# EAGLE design captouchIC (EAGLE 9.3.0)
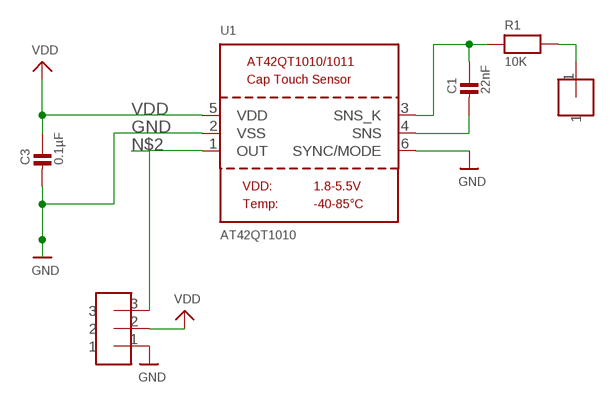
[diagram p0: schematic, sheet 1]

## Parts
C1  22nF  CAP_CERAMIC_0805  [_0805]
C3  0.1µF  CAP_CERAMIC_0805  [_0805]
R1  10K  RESISTOR_0805  [_0805]
U1  AT42QT1010  AT42QT1010/1  [SOT23-6]
U$1  HEADER-1-TESTPOINT  [TESTPOINT-1]
U$6  HEADER-3  [HEADER-3]

## Nets
CAPPAD: R1.2 U$1.1
GND: C3.2 U1.2(VSS) U1.6(SYNC/MODE) U$6.1
N$2: U1.1(OUT) U$6.3
N$3: C1.2 U1.4(SNS)
N$4: C1.1 R1.1 U1.3(SNS_K)
VDD: C3.1 U1.5(VDD) U$6.2

## Library data of the parts
C1 C3 = microbuilder:CAP_CERAMIC: Ceramic Capacitors For new designs, use the packages preceded by an '_' character since they are more reliable: The following footprints should be used on most boards: _0402 - Standard footprint for regular board layouts _0603 - Standard footprint for regular board layouts _0805 - Standard footprint for regular board layouts For extremely tight-pitch boards where space is at a premium, the following 'micro-pitch' footprints can be used (smaller pads, no silkscreen outline, etc.): _0402MP - Micro-pitch footprint for very dense/compact boards _0603MP - Micro-pitch footprint for very dense/compact boards _0805MP - Micro-pitch footprint for very dense/compact boards Commonly Stocked Parts 0402 - 0402 Surface Mount Capacitors 16pF 50V 5% [Digikey: 445-4899-2-ND] 18pF 50V 5% [Digikey: 490-1281-2-ND] 22pF 50V 5% [Digikey: 490-1283-2-ND] 68pF 50V 5% [Digikey: 490-1289-2-ND] 0.1uF 10V 10% [Digikey: 490-1318-2-ND] 1.0uF 6.3V 10% [Digikey: 490-1320-2-ND] 0603 - 0603 Surface Mount Capacitors 16 pF 50V 5% [Digikey: 445-5051-2-ND] 22 pF 50V [Digikey: PCC220ACVTR-ND] 33 pF 50V 5% [Digikey: 490-1415-1-ND] 56pF 50V 5% [Digikey: 490-1421-1-ND] 220pF 50V 5% [Digikey: 445-1285-1-ND] 680 pF 50V 2200 pF 50V 5% C0G [Digikey: 445-1297-1-ND] 5600 pF 100V 5% X7R [Digikey: 478-3711-1-ND] 0.1 µF 25V 10% [Digikey: PCC2277TR-ND] 0.22 µF 16V 10% X7R [Digikey: 445-1318-1-ND] 1.0 µF 25V 10% [Digikey: 445-5146-2-ND] 0603 - RF Specific 3pF 250V +/-0.1pF RF [Digikey: 712-1347-1-ND] 18 pF 250V 5% [Digikey: 478-3505-1-ND or 712-1322-1-ND] 56 pF 250V 5% C0G RF [Digikey: 490-4867-1-ND] 68 pF 250V RF [Digikey: 490-4868-1-ND] 0805 - 0805 Surface Mount Capacitors 220 pF 250V 2% RF Ceramic Capacitor [Digikey: 712-1398-1-ND] 1000 pF 50V 2% NP0 Ceramic Capacitor [Digikey: 478-3760-1-ND] 0.1 µF 25V 10% Ceramic Capacitor [Digikey: PCC1828TR-ND] 1.0 µF 16V 10% Ceramic Capacitor[Digikey: 490-1691-2-ND] 10.0 µF 10V 10% Ceramic Capacitor[Digikey: 709-1228-1-ND] 10.0 uF 16V 10% Ceramic Capacitor [Digikey: 478-5165-2-ND] 47 uF 6.3V 20% Ceramic Capacitor [Digikey: 587-1779-1-ND or 399-5506-1-ND] 1206 - 1206 Surface Mount Capacitors 47uF 10V 20% Ceramic Capacitor [Digikey: 490-5528-1-ND or 399-5508-1-ND or 445-6010-1-ND] 100uF 6.3V -20%, +80% Y5V Ceramic Capacitor (Digikey: 490-4512-1-ND, Mouser: 81-GRM31CF50J107ZE1L)
R1 = microbuilder:RESISTOR: Resistors For new designs, use the packages preceded by an '_' character since they are more reliable: The following footprints should be used on most boards: _0402 - Standard footprint for regular board layouts _0603 - Standard footprint for regular board layouts _0805 - Standard footprint for regular board layouts For extremely tight-pitch boards where space is at a premium, the following 'micro-pitch' footprints can be used (smaller pads, no silkscreen outline, etc.): _0402MP - Micro-pitch footprint for very dense/compact boards _0603MP - Micro-pitch footprint for very dense/compact boards _0805MP - Micro-pitch footprint for very dense/compact boards
U1 = microbuilder:AT42QT1010/1: AT42QT1010/1011 - Single Button Cap Touch Sensors AT42QT1010 - Auto recalibration AT42QT1011 - Remains on as long as touch is detected
U$1 = homemade-hardware:HEADER-1
U$6 = homemade-hardware:HEADER-3

## Board
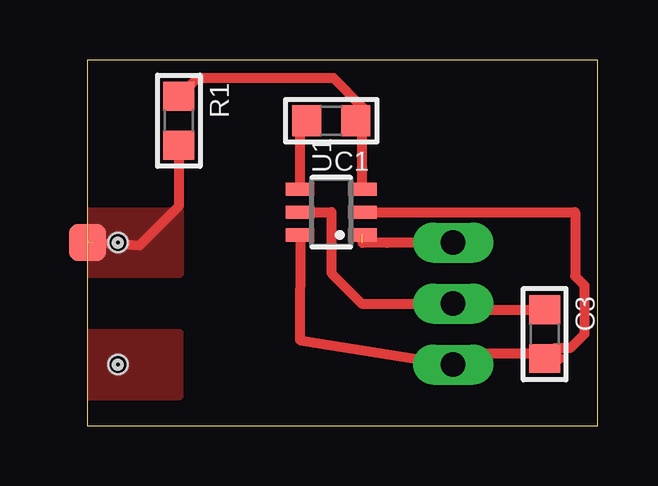
[diagram p1: board, top side]

Size 21.26 x 15.23 mm. Coordinates in mm from the lower left corner, seen from the top.
Outline: 0,0 21.26,0 21.26,15.23 0,15.23 0,0
Copper layers (1*16): Top 0.035mm / dielectric 1.5mm / Bottom 0.035mm
Design rules "default": minimum track width 16mil, minimum drill 0.8mm, track to track 0.8mm, track to pad 0.8mm, pad to pad 0.8mm, via to via 0.8mm, smd to smd 0mil, copper to edge 1mil, drill to drill 1mil, minimum pad ring 10mil, minimum via ring 10mil, stop-mask expansion 1mil, vias tented up to drill 30mil, thermal gap 10mil
Holes 0.25 mm at 1.27,7.62 1.27,2.54
Holes 0.4 mm at 1.27,7.62 1.27,2.54
Holes 0.8 mm at 1.27,7.62 1.27,2.54

### Footprints (pad centres in the part's own frame; a part is rotated, then mirrored left to right if it is on the bottom)
_0805 = smd 1.2 x 1.3: 1 -1.016,0; 2 1.016,0
SOT23-6 = smd 0.55 x 1.2: 1 -0.95,-1.3; 2 0,-1.3; 3 0.95,-1.3; 4 0.95,1.3; 5 0,1.3; 6 -0.95,1.3
TESTPOINT-1 = smd 1.524 x 1.524: 1 0,0
HEADER-3 = drill 1.016 pad 1.676 long: 1 0,0; 2 0,2.54; 3 0,5.08

### Placement (x,y rotation side)
C1  10.16,12.7 180 top
C3  19.05,3.81 270 top
R1  3.81,12.7 270 top
U1  10.16,8.89 90 top
U$1  0,7.62 0 top
U$6  15.24,2.54 0 top

### Tracks (layer width: path | path; a pad name or v marks a point on that pad's centre or on a via)
CAPPAD  (1 unrouted)
  Top 0.406: 0.23,7.63 2.17,7.51 3.81,9.14 3.81,10.16 R1.2
  pour Top (no thermals): 0,8.89 3.81,8.89 3.81,6.35 0,6.35
GND
  Top 0.406: C3.2 18.7,3.02 15.68,3.02 U$6.1 8.85,3.56 U1.6 | 19.69,2.79 C3.2 | U1.2 20.32,8.89 20.32,6.22 20.7,5.84 20.7,3.81 20.12,3.22 19.48,3.22 C3.2
N$2  (1 unrouted)
  Top 0.406: 11.46,7.61 12.48,7.61 12.48,7.62 U$6.3
N$3
  Top 0.406: U1.4 8.86,12.42 C1.2
N$4
  Top 0.406: R1.1 4.57,14.48 10.25,14.48 11.46,13.27 C1.1 11.46,12.42 U1.3
NS1
  pour Top: 0,1.27 3.81,1.27 3.81,3.81 0,3.81
VDD
  Top 0.406: C3.1 18.7,4.83 15.68,4.83 U$6.2 11.43,5.08 10.16,6.35 10.16,8.89 U1.5